# EAGLE design PCB (EAGLE 9.6.2)
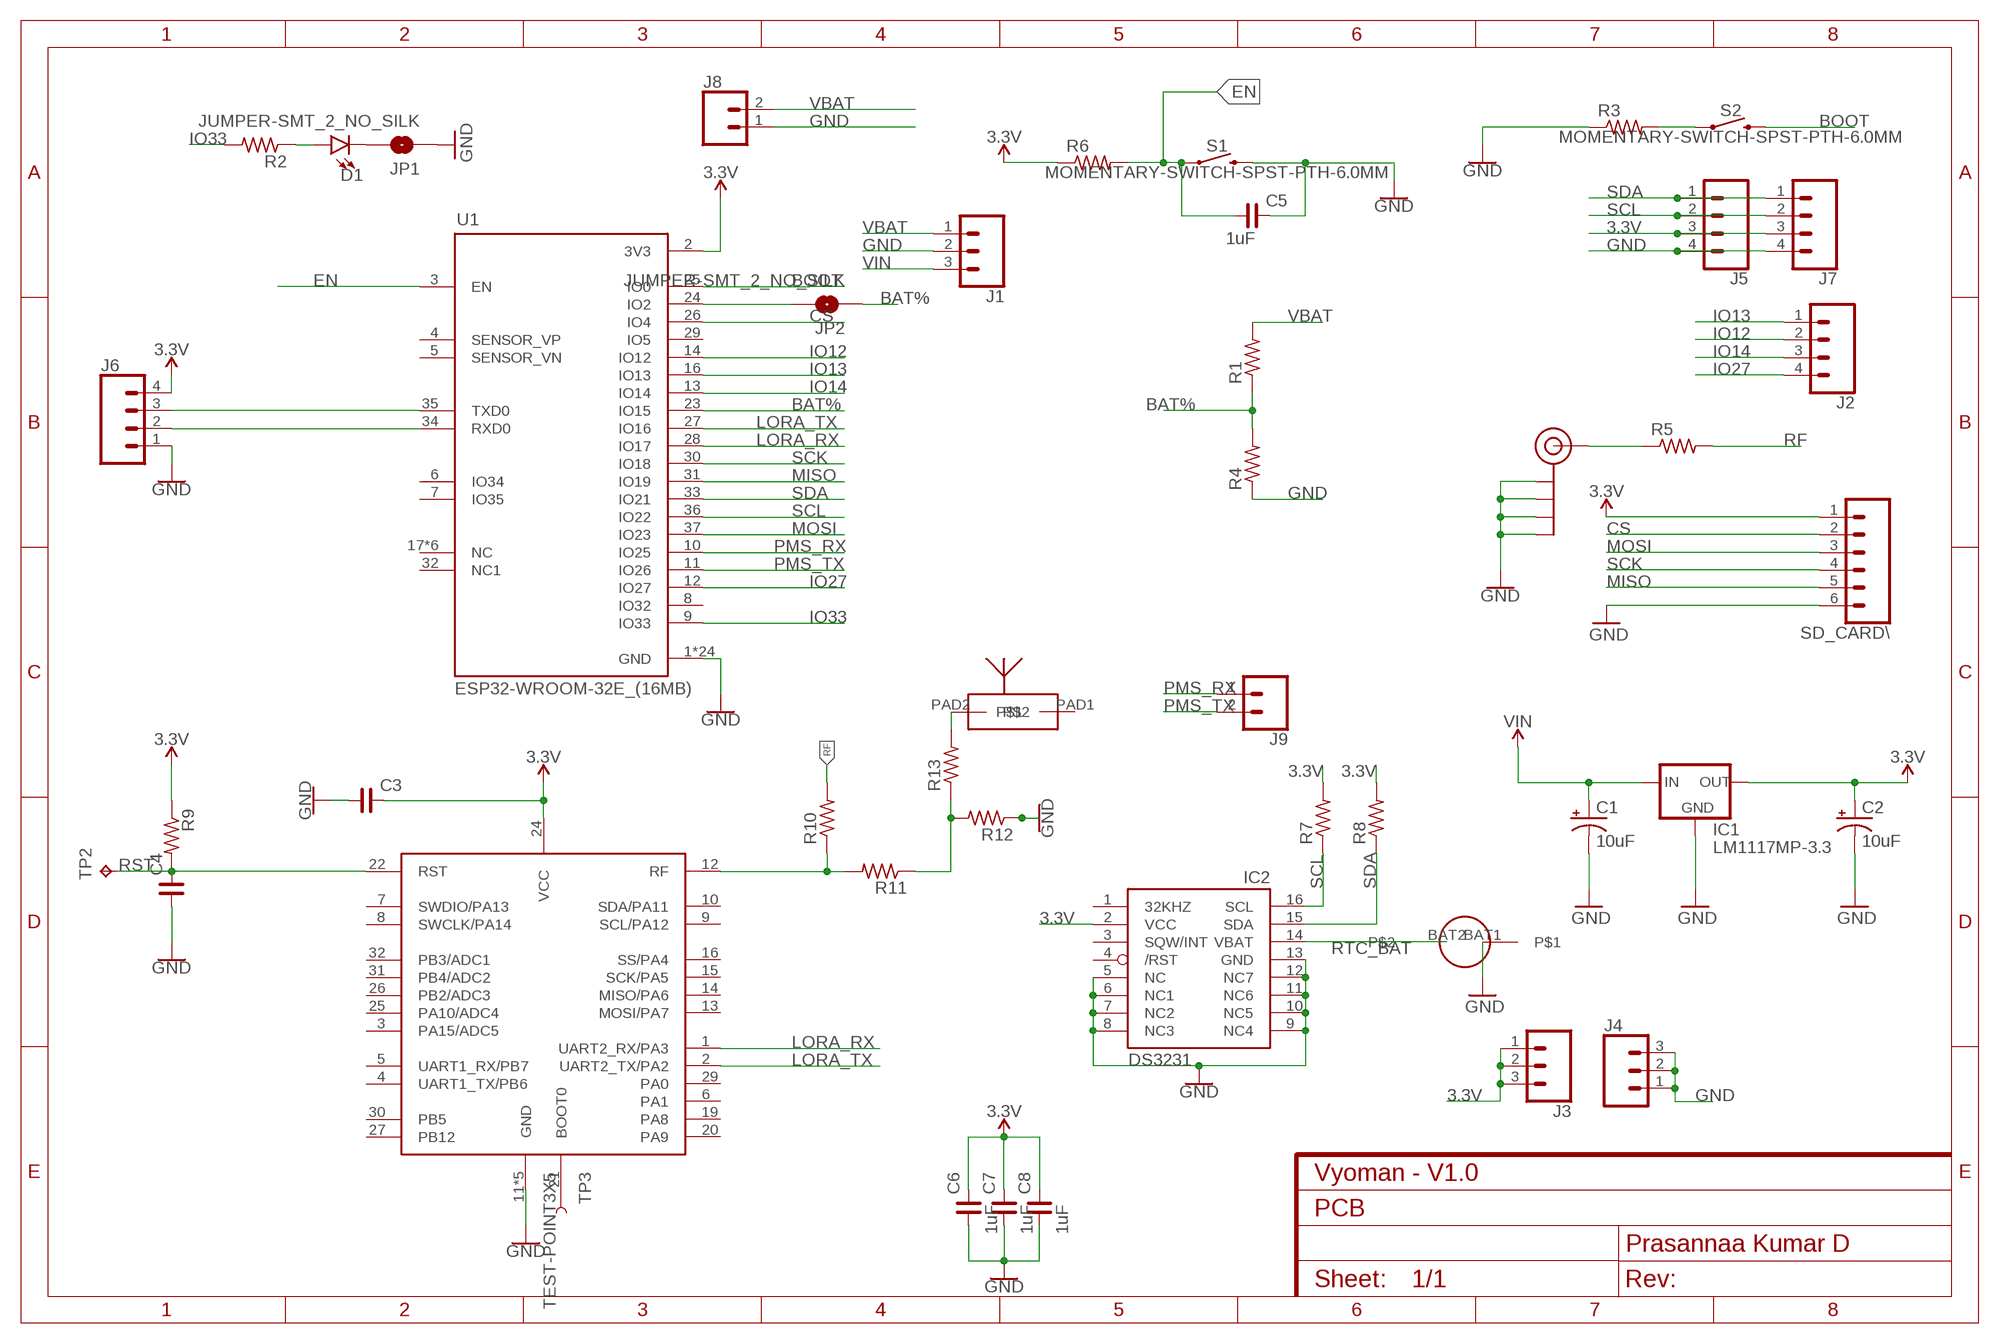
[diagram p0: schematic, sheet 1]
FRAME1 (FRAME-A4L): CNAME: Vyoman - V1.0; CREVISION: 1.0; DESIGNER: Prasannaa Kumar D

## Parts
C1  10uF  10UF-TANT  [EIA3216]
C2  10uF  10UF-TANT  [EIA3216]
C3  C_0805  [C0805]
C4  C_0805  [C0805]
C5  1uF  C_0805  [C0805]
C6  1uF  C_0805  [C0805]
C7  1uF  C_0805  [C0805]
C8  1uF  C_0805  [C0805]
D1  LED1206  [LED-1206]
IC1  LM1117MP-3.3  [SOT223]
IC2  DS3231/SO  [SO16W]
J1  CONN_031X03_NO_SILK  [1X03_NO_SILK]
J2  CONN_041X04_NO_SILK  [1X04_NO_SILK]
J3  CONN_031X03_NO_SILK  [1X03_NO_SILK]
J4  CONN_031X03_NO_SILK  [1X03_NO_SILK]
J5  CONN_041X04_NO_SILK  [1X04_NO_SILK]
J6  CONN_041X04_NO_SILK  [1X04_NO_SILK]
J7  CONN_041X04_NO_SILK  [1X04_NO_SILK]
J8  CONN_021X02_NO_SILK  [1X02_NO_SILK]
J9  CONN_021X02_NO_SILK  [1X02_NO_SILK]
J$1  SMA_EDGE  [SMA-EDGE]
JP1  JUMPER-SMT_2_NO_SILK  [SMT-JUMPER_2_NO_SILK]
JP2  JUMPER-SMT_2_NO_SILK  [SMT-JUMPER_2_NO_SILK]
R1  CRCW08050000Z0EA  [RES_0805]
R2  CRCW08050000Z0EA  [RES_0805]
R3  CRCW08050000Z0EA  [RES_0805]
R4  CRCW08050000Z0EA  [RES_0805]
R5  CRCW08050000Z0EA  [RES_0805]
R6  CRCW08050000Z0EA  [RES_0805]
R7  CRCW08050000Z0EA  [RES_0805]
R8  CRCW08050000Z0EA  [RES_0805]
R9  CRCW08050000Z0EA  [RES_0805]
R10  CRCW08050000Z0EA  [RES_0805]
R11  CRCW08050000Z0EA  [RES_0805]
R12  CRCW08050000Z0EA  [RES_0805]
R13  CRCW08050000Z0EA  [RES_0805]
S1  MOMENTARY-SWITCH-SPST-PTH-6.0MM  [TACTILE_SWITCH_PTH_6.0MM]
S2  MOMENTARY-SWITCH-SPST-PTH-6.0MM  [TACTILE_SWITCH_PTH_6.0MM]
SD_CARD\  CONN_06NO_SILK_FEMALE_PTH  [1X06_NO_SILK]
TP2  TPTP12R  [TP12R]
TP3  TEST-POINT3X5  [PAD.03X.05]
U1  ESP32-WROOM-32E_(16MB)  [MODULE_ESP32-WROOM-32E_(16MB)]
U$1  RAK3172HF  [RAK3172]
U$2  CR1220_HOLDER  [CR1220_HOLDER]
U$9  NN02-224  [NN02-224]

## Nets
3.3V: C2.A(+) C3.2 C6.2 C7.2 C8.2 IC1.2(OUT) IC1.4(OUT) IC2.2(VCC) J3.1 J3.2 J3.3 J5.3 J6.4 J7.3 R6.1 R7.2 R8.2 R9.1 SD_CARD\.1 U1.2(3V3) U$1.24(VCC)
BAT%: JP2.1 R1.1 R4.2 U1.23(IO15)
BOOT: S2.3 U1.25(IO0)
CS: SD_CARD\.2 U1.26(IO4)
EN: C5.1 R6.2 S1.1 U1.3(EN)
GND: C1.C(-) C2.C(-) C3.1 C4.1 C5.2 C6.1 C7.1 C8.1 IC1.1(GND) IC2.5(NC) IC2.6(NC1) IC2.7(NC2) IC2.8(NC3) IC2.9(NC4) IC2.10(NC5) IC2.11(NC6) IC2.12(NC7) IC2.13(GND) J1.2 J4.1 J4.2 J4.3 J5.4 J6.1 J7.4 J8.1 J$1.GND@0(GND) J$1.GND@1(GND) J$1.GND@2(GND) J$1.GND@3(GND) JP1.1 R3.1 R4.1 R12.1 S1.3 SD_CARD\.6 U1.1(GND) U1.15(GND) U1.38(GND) U1.39_1(GND) U1.39_2(GND) U1.39_3(GND) U1.39_4(GND) U1.39_5(GND) U1.39_6(GND) U1.39_7(GND) U1.39_8(GND) U1.39_9(GND) U1.39_10(GND) U1.39_11(GND) U1.39_12(GND) U1.39_13(GND) U1.39_14(GND) U1.39_15(GND) U1.39_16(GND) U1.39_17(GND) U1.39_18(GND) U1.39_19(GND) U1.39_20(GND) U1.39_21(GND) U$1.11(GND) U$1.17(GND) U$1.18(GND) U$1.23(GND) U$1.28(GND) U$2.BAT1
IO12: J2.2 U1.14(IO12)
IO13: J2.1 U1.16(IO13)
IO14: J2.3 U1.13(IO14)
IO27: J2.4 U1.12(IO27)
IO33: R2.2 U1.9(IO33)
LORA_RX: U1.28(IO17) U$1.1(UART2_RX/PA3)
LORA_TX: U1.27(IO16) U$1.2(UART2_TX/PA2)
MISO: SD_CARD\.5 U1.31(IO19)
MOSI: SD_CARD\.3 U1.37(IO23)
N$1: TP3.P$1 U$1.21(BOOT0)
N$2: D1.C JP1.2
N$3: R3.2 S2.1
N$4: J6.3 U1.35(TXD0)
N$5: J6.2 U1.34(RXD0)
N$6: D1.A R2.1
N$7: R13.2 U$9.PAD2
N$8: J$1.SIG(SIGNAL) R5.1
N$9: JP2.2 U1.24(IO2)
N$15: R11.1 R12.2 R13.1
N$16: R10.1 R11.2 U$1.12(RF)
PMS_RX: J9.1 U1.10(IO25)
PMS_TX: J9.2 U1.11(IO26)
RF: R5.2 R10.2
RST: C4.2 R9.2 TP2.TP U$1.22(RST)
RTC_BAT: IC2.14(VBAT) U$2.BAT2
SCK: SD_CARD\.4 U1.30(IO18)
SCL: IC2.16(SCL) J5.2 J7.2 R7.1 U1.36(IO22)
SDA: IC2.15(SDA) J5.1 J7.1 R8.1 U1.33(IO21)
VBAT: J1.1 J8.2 R1.2
VIN: C1.A(+) IC1.3(IN) J1.3
Unconnected: IC2.1(32KHZ) IC2.3(SQW/INT) IC2.4(/RST) U1.4(SENSOR_VP) U1.5(SENSOR_VN) U1.6(IO34) U1.7(IO35) U1.8(IO32) U1.17(NC) U1.18(NC) U1.19(NC) U1.20(NC) U1.21(NC) U1.22(NC) U1.29(IO5) U1.32(NC1) U$1.3(PA15/ADC5) U$1.4(UART1_TX/PB6) U$1.5(UART1_RX/PB7) U$1.6(PA1) U$1.7(SWDIO/PA13) U$1.8(SWCLK/PA14) U$1.9(SCL/PA12) U$1.10(SDA/PA11) U$1.13(MOSI/PA7) U$1.14(MISO/PA6) U$1.15(SCK/PA5) U$1.16(SS/PA4) U$1.19(PA8) U$1.20(PA9) U$1.25(PA10/ADC4) U$1.26(PB2/ADC3) U$1.27(PB12) U$1.29(PA0) U$1.30(PB5) U$1.31(PB4/ADC2) U$1.32(PB3/ADC1) U$9.PAD1

## Library data of the parts
C1 C2 = SparkFun-Retired:10UF-TANT: 10uF Tantalum SMT CAP-00811- 16V 10% (EIA-3216); PROD_ID: CAP-00811
C3-C8 = rc-master-smd:C_: NON-POLARIZED CAP
D1 = SparkFun-LED:LED: LED (Generic) Standard schematic elements and footprints for 5mm, 3mm, 1206, and 0603 sized LEDs. Generic LEDs with no color specified.
IC1 = lm1117_10:LM1117?-*: 800mA Low-Dropout Linear Regulator Source: http://www.ti.com/lit/ds/symlink/lm1117-n.pdf; MF: Texas Instruments; MPN: LM1117MP-3.3; OC_FARNELL: 9778195; OC_NEWARK: 28X3416
IC2 = DS3231:DS3231: Check prices <https://pricing.snapeda.com/parts/DS3231/Maxim%20Integrated/view-part?ref=eda>; AVAILABILITY: No availability data; DESCRIPTION: Real Time Clock (RTC) IC Clock/Calendar I²C, 2-Wire Serial 16-SOIC (0.295, 7.50mm Width); MF: Maxim Integrated; MP: DS3231; PACKAGE: SOIC-16 Maxim Integrated; PRICE: None; PURCHASE-URL: https://pricing.snapeda.com/search/part/DS3231/?ref=eda
J1 J3 J4 = SparkFun-Connectors:CONN_03: Multi connection point. Often used as Generic Header-pin footprint for 0.1 inch spaced/style header connections On any of the 0.1 inch spaced packages, you can populate with these: Break Away Headers - Straight <https://www.sparkfun.com/products/116> (PRT-00116) Break Away Male Headers - Right Angle <https://www.sparkfun.com/products/553> (PRT-00553) Female Headers <https://www.sparkfun.com/products/115> (PRT-00115) Break Away Headers - Machine Pin <https://www.sparkfun.com/products/117> (PRT-00117) Break Away Female Headers - Swiss Machine Pin <https://www.sparkfun.com/products/743> (PRT-00743) Stackable Header - 3 Pin (Female, 0.1") <https://www.sparkfun.com/products/13875> (PRT-13875) For SCREWTERMINALS and SPRING TERMINALS visit here: Screw Terimnals on SparkFun.com <https://www.sparkfun.com/search/results?term=Screw+Terminals> (5mm/3.5mm/2.54mm spacing) This device is also useful as a general connection point to wire up your design to another part of your project. Our various solder wires solder well into these plated through hole pads. Hook-Up Wire - Assortment (Stranded, 22 AWG) <https://www.sparkfun.com/products/11375> (PRT-11375) Hook-Up Wire - Assortment (Solid Core, 22 AWG) <https://www.sparkfun.com/products/11367> (PRT-11367) View the entire wire category on our website here <https://www.sparkfun.com/categories/141> Special notes: Molex polarized connector foot print use with SKU : PRT-08232 with associated crimp pins and housings.
J2 J5-J7 = SparkFun-Connectors:CONN_04: Multi connection point. Often used as Generic Header-pin footprint for 0.1 inch spaced/style header connections On any of the 0.1 inch spaced packages, you can populate with these: Break Away Headers - Straight <https://www.sparkfun.com/products/116> (PRT-00116) Break Away Male Headers - Right Angle <https://www.sparkfun.com/products/553> (PRT-00553) Female Headers <https://www.sparkfun.com/products/115> (PRT-00115) Break Away Headers - Machine Pin <https://www.sparkfun.com/products/117> (PRT-00117) Break Away Female Headers - Swiss Machine Pin <https://www.sparkfun.com/products/743> (PRT-00743) For SCREWTERMINALS and SPRING TERMINALS visit here: Screw Terimnals on SparkFun.com <https://www.sparkfun.com/search/results?term=Screw+Terminals> (5mm/3.5mm/2.54mm spacing) This device is also useful as a general connection point to wire up your design to another part of your project. Our various solder wires solder well into these plated through hole pads. Hook-Up Wire - Assortment (Stranded, 22 AWG) <https://www.sparkfun.com/products/11375> (PRT-11375) Hook-Up Wire - Assortment (Solid Core, 22 AWG) <https://www.sparkfun.com/products/11367> (PRT-11367) View the entire wire category on our website here <https://www.sparkfun.com/categories/141> Special notes: Molex polarized connector foot print use with SKU : PRT-08231 with associated crimp pins and housings. 1MM SMD Version SKU: PRT-10208; PROD_ID: CONN-09696
J8 J9 = SparkFun-Connectors:CONN_02: Multi connection point. Often used as Generic Header-pin footprint for 0.1 inch spaced/style header connections On any of the 0.1 inch spaced packages, you can populate with these: Break Away Headers - Straight <https://www.sparkfun.com/products/116> (PRT-00116) Break Away Male Headers - Right Angle <https://www.sparkfun.com/products/553> (PRT-00553) Female Headers <https://www.sparkfun.com/products/115> (PRT-00115) Break Away Headers - Machine Pin <https://www.sparkfun.com/products/117> (PRT-00117) Break Away Female Headers - Swiss Machine Pin <https://www.sparkfun.com/products/743> (PRT-00743) For SCREWTERMINALS and SPRING TERMINALS visit here: Screw Terimnals on SparkFun.com <https://www.sparkfun.com/search/results?term=Screw+Terminals> (5mm/3.5mm/2.54mm spacing) This device is also useful as a general connection point to wire up your design to another part of your project. Our various solder wires solder well into these plated through hole pads. Hook-Up Wire - Assortment (Stranded, 22 AWG) <https://www.sparkfun.com/products/11375> (PRT-11375) Hook-Up Wire - Assortment (Solid Core, 22 AWG) <https://www.sparkfun.com/products/11367> (PRT-11367) View the entire wire category on our website here <https://www.sparkfun.com/categories/141> Special notes: Molex polarized connector foot print use with: PRT-08233 with associated crimp pins and housings. 2.54_SCREWTERM for use with PRT-10571. 3.5mm Screw Terminal footprints for PRT-08084 5mm Screw Terminal footprints for use with PRT-08432
J$1 = SparkFun-Retired:SMA_EDGE: SMA Antenna Connector End launch SMA connector. The paste layer has been removed so that the connector can be hand soldered onto the board after reflow.
JP1 JP2 = SparkFun-Jumpers:JUMPER-SMT_2_NO: Normally open jumper This jumper has two pads in close proximity to each other. Apply solder to close the connection. Round pads are easier to solder for beginners, but are a lot larger. SparkFun Product that uses the round pads: SparkFun EL Sequencer <https://www.sparkfun.com/products/12781>
R1-R13 = Resistor_Capacitor:CRCW08050000Z0EA: RES SMD 0 OHM JUMPER 1/8W 0805 Manufacturer's datasheet <http://www.vishay.com/docs/20035/dcrcwe3.pdf>; CREATED_BY: PCBLayout.com; DIGIKEY_PART_NUMBER: 541-0.0ATR-ND; MANUFACTURER: Vishay Dale; MPN: CRCW08050000Z0EA; PACKAGE: SMD 0805
S1 S2 = SparkFun-Switches:MOMENTARY-SWITCH-SPST: Momentary Switch (Pushbutton) - SPST Normally-open (NO) SPST momentary switches (buttons, pushbuttons). Variants PTH-12MM - 12mm square, through-hole Momentary Pushbutton Switch - 12mm Square <https://www.sparkfun.com/products/9190> (COM-09190) PTH-6.0MM, PTH-6.0MM-KIT - 6.0mm square, through-hole Mini Pushbutton Switch <https://www.sparkfun.com/products/97> (COM-00097) KIT package intended for soldering kit's - only one side of pads' copper is exposed. PTH-RIGHT-ANGLE-KIT - Right-angle, through-hole Right Angle Tactile Button <https://www.sparkfun.com/products/10791> - Used on SparkFun BigTime Watch Kit <https://www.sparkfun.com/products/11734> SMD-12MM - 12mm square, surface-mount Tactile Button - SMD (12mm) <https://www.sparkfun.com/products/12993> (COM-12993) Used on SparkFun PicoBoard <https://www.sparkfun.com/products/11888> SMD-4.5MM - 4.5mm Square Trackball Switch Used on SparkFun Blackberry Trackballer Breakout <https://www.sparkfun.com/products/13169> SMD-4.6MMX2.8MM - 4.60mm x 2.80mm, surface mount Used on SparkFun SAMD21 Mini Breakout <https://www.sparkfun.com/products/13664> SMD-5.2MM, SMD-5.2-REDUNDANT - 5.2mm square, surface-mount Mini Pushbutton Switch - SMD <https://www.sparkfun.com/products/8720> (COM-08720) Used on Arduino Pro Mini <https://www.sparkfun.com/products/11114> REDUNDANT package connects both switch circuits together SMD-6.0X3.5MM - 6.0 x 3.5mm, surface mount Momentary Reset Switch SMD <https://www.sparkfun.com/products/8229> (COM-08229) SMD-6.2MM-TALL - 6.2mm square, surface mount Tactile Button - SMD (6mm) <https://www.sparkfun.com/products/12992> Used on SparkFun Digital Sandbox <https://www.sparkfun.com/products/12651> SMD-RIGHT-ANGLE - Right-angle, surface mount Used on SparkFun Block for Intel® Edison - Arduino <https://www.sparkfun.com/products/13036>; PROD_ID: SWCH-08441; SF_SKU: COM-00097
SD_CARD\ = SparkFun-Connectors:CONN_06: Multi connection point. Often used as Generic Header-pin footprint for 0.1 inch spaced/style header connections On any of the 0.1 inch spaced packages, you can populate with these: Break Away Headers - Straight <https://www.sparkfun.com/products/116> (PRT-00116) Break Away Male Headers - Right Angle <https://www.sparkfun.com/products/553> (PRT-00553) Female Headers <https://www.sparkfun.com/products/115> (PRT-00115) Break Away Headers - Machine Pin <https://www.sparkfun.com/products/117> (PRT-00117) Break Away Female Headers - Swiss Machine Pin <https://www.sparkfun.com/products/743> (PRT-00743) Arduino Stackable Header - 6 Pin <https://www.sparkfun.com/products/9280> (PRT-09280) For SCREWTERMINALS and SPRING TERMINALS visit here: Screw Terimnals on SparkFun.com <https://www.sparkfun.com/search/results?term=Screw+Terminals> (5mm/3.5mm/2.54mm spacing) This device is also useful as a general connection point to wire up your design to another part of your project. Our various solder wires solder well into these plated through hole pads. Hook-Up Wire - Assortment (Stranded, 22 AWG) <https://www.sparkfun.com/products/11375> (PRT-11375) Hook-Up Wire - Assortment (Solid Core, 22 AWG) <https://www.sparkfun.com/products/11367> (PRT-11367) View the entire wire category on our website here <https://www.sparkfun.com/categories/141>; PROD_ID: CONN-08437
TP2 = testpad:TP: Test pad
TP3 = SparkFun-Connectors:TEST-POINT: SparkFun Test Points Bare copper test points for troubleshooting or In-Circuit-Testing. These are used by our Production team for verifying production board runs using pogo-pins on test beds. SparkFun Products: SparkFun LSM9DS1 Breakout <https://www.sparkfun.com/products/13284> SparkFun PSOC <https://www.sparkfun.com/products/13714> SparkFun Load Cell Amplifier <https://www.sparkfun.com/products/13879>
U1 = ESP32-WROOM-32E:ESP32-WROOM-32E_(16MB): Bluetooth, WiFi 802.11b/g/n, Bluetooth v4.2 +EDR, Class 1, 2 and 3 Transceiver Module 2.4GHz ~ 2.5GHz Integrated, Trace Surface Mount Check prices <https://pricing.snapeda.com/parts/ESP32-WROOM-32E%20%2816MB%29/Espressif%20Systems/view-part?ref=eda>; AVAILABILITY: Not in stock; DESCRIPTION: Bluetooth, WiFi 802.11b/g/n, Bluetooth v4.2 +EDR, Class 1, 2 and 3 Transceiver Module 2.4GHz ~ 2.5GHz Integrated, Trace Surface Mount; MF: Espressif Systems; MP: ESP32-WROOM-32E (16MB); PACKAGE: Module Espressif Systems; PRICE: None
U$1 = RAK3172-Breakout:RAK3172: RAK4260 LoRaWAN module from RAKwireless.
U$2 = CR1220_HOLDER:CR1220_HOLDER
U$9 = NN02-224:NN02-224

## Net classes
0 Default: width 0.203 mm

## Board
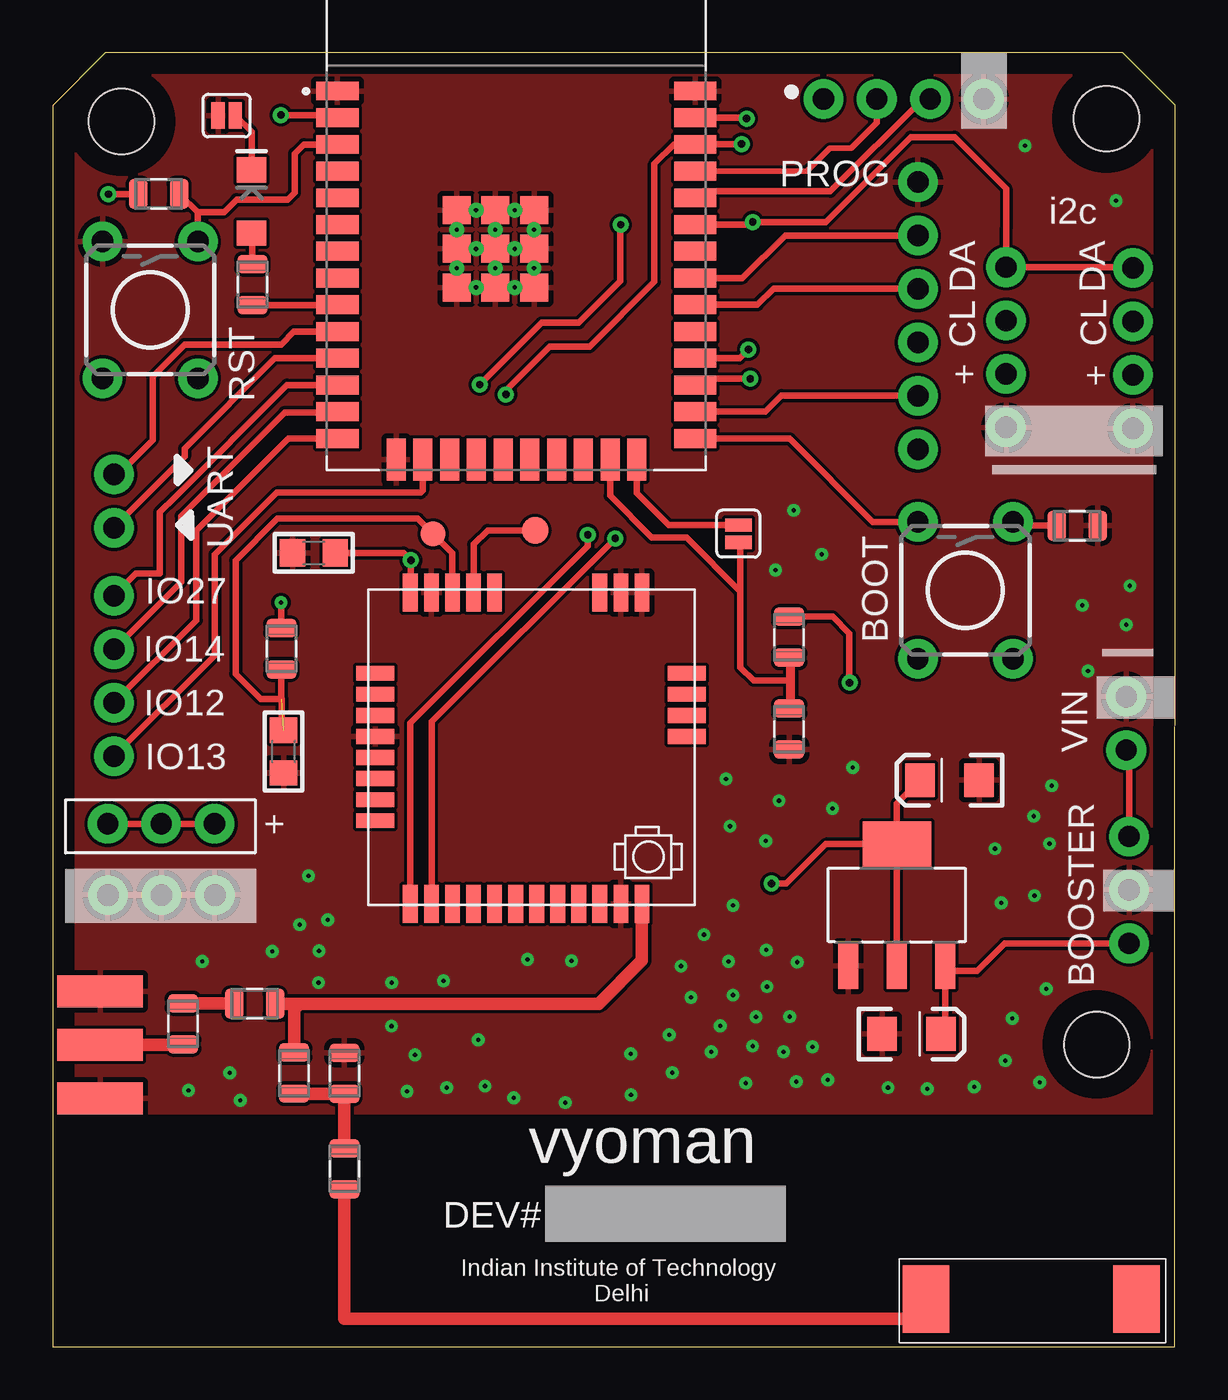
[diagram p1: board, top side]
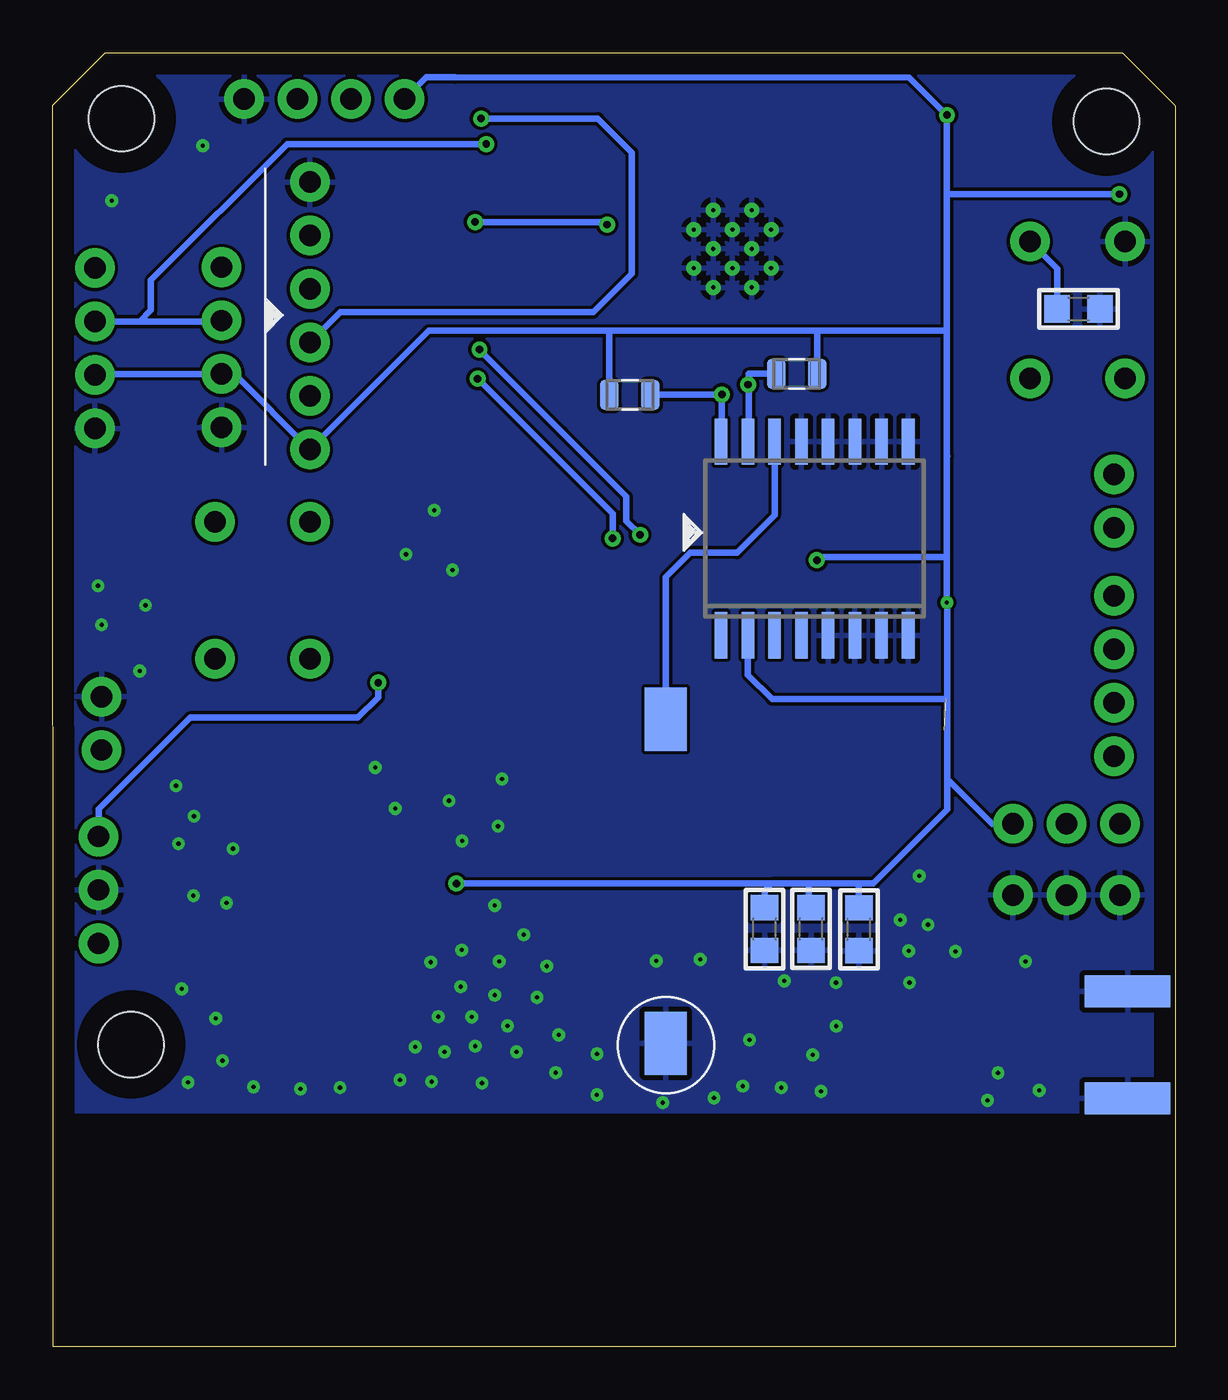
[diagram p2: board, bottom side, seen from below]

Size 53.31 x 61.49 mm. Coordinates in mm from the lower left corner, seen from the top.
Outline: 0.01,58.97 0,0 53.29,0.01 53.31,58.99 50.81,61.49 2.51,61.47 0.01,58.97
Copper layers (1*16): Top 0.035mm / dielectric 1.5mm / Bottom 0.035mm
Design rules "default": minimum track width 6mil, minimum drill 0.35mm, track to track 6mil, track to pad 6mil, pad to pad 6mil, via to via 6mil, smd to smd 6mil, copper to edge 40mil, drill to drill 6mil, minimum pad ring 10mil, minimum via ring 8mil, stop-mask expansion 4mil, vias tented up to drill 0mil, thermal gap 10mil
Holes 3.1 mm at 3.26,58.22 49.59,14.36 50.04,58.35

### Footprints (pad centres in the part's own frame; a part is rotated, then mirrored left to right if it is on the bottom)
EIA3216 = smd 1.4 x 1.6: A 1.4,0; C -1.4,0
C0805 = smd 1.2 x 1.3: 1 -1.016,0; 2 1.016,0
LED-1206 = smd 1.2 x 1.4: A -1.5,0; C 1.5,0
SOT223 = smd 0.95 x 2.15: 1 -2.3,-2.9; 2 0,-2.9; 3 2.3,-2.9 | smd 3.25 x 2.15: 4 0,2.9
SO16W = smd 0.6 x 2.2: 1 -4.445,-4.6; 2 -3.175,-4.6; 3 -1.905,-4.6; 4 -0.635,-4.6; 5 0.635,-4.6; 6 1.905,-4.6; 7 3.175,-4.6; 8 4.445,-4.6; 9 4.445,4.6; 10 3.175,4.6; 11 1.905,4.6; 12 0.635,4.6; 13 -0.635,4.6; 14 -1.905,4.6; 15 -3.175,4.6; 16 -4.445,4.6
1X03_NO_SILK = drill 1.016 pad 1.88: 1 0,0; 2 2.54,0; 3 5.08,0
1X04_NO_SILK = drill 1.016 pad 1.88: 1 0,0; 2 2.54,0; 3 5.08,0; 4 7.62,0
1X02_NO_SILK = drill 1.016 pad 1.88: 1 0,0; 2 2.54,0
SMA-EDGE = smd 1.524 x 4.064: GND@0 0,0; GND@1 5.08,0; SIG 2.54,0 | smd 1.524 x 4.064 bottom: GND@2 0,0; GND@3 5.08,0
SMT-JUMPER_2_NO_SILK = smd 0.635 x 1.27: 1 -0.406,0; 2 0.406,0
RES_0805 = smd 0.87 x 1.42: 1 -0.975,0; 2 0.975,0
TACTILE_SWITCH_PTH_6.0MM = drill 1.016 pad 1.88: 1 -3.251,2.261; 2 3.251,2.261; 3 -3.251,-2.261; 4 3.251,-2.261
1X06_NO_SILK = drill 1.016 pad 1.88: 1 0,0; 2 2.54,0; 3 5.08,0; 4 7.62,0; 5 10.16,0; 6 12.7,0
TP12R = smd 1.2 x 1.2: TP 0,0
PAD.03X.05 = smd 1.27 x 1.27: P$1 0,0
MODULE_ESP32-WROOM-32E_(16MB) = smd 2 x 0.9: 1 -8.5,5.26; 2 -8.5,3.99; 3 -8.5,2.72; 4 -8.5,1.45; 5 -8.5,0.18; 6 -8.5,-1.09; 7 -8.5,-2.36; 8 -8.5,-3.63; 9 -8.5,-4.9; 10 -8.5,-6.17; 11 -8.5,-7.44; 12 -8.5,-8.71; 13 -8.5,-9.98; 14 -8.5,-11.25; 25 8.5,-11.25; 26 8.5,-9.98; 27 8.5,-8.71; 28 8.5,-7.44; 29 8.5,-6.17; 30 8.5,-4.9; 31 8.5,-3.63; 32 8.5,-2.36; 33 8.5,-1.09; 34 8.5,0.18; 35 8.5,1.45; 36 8.5,2.72; 37 8.5,3.99; 38 8.5,5.26 | smd 0.9 x 2: 15 -5.715,-12.25; 16 -4.445,-12.25; 17 -3.175,-12.25; 18 -1.905,-12.25; 19 -0.635,-12.25; 20 0.635,-12.25; 21 1.905,-12.25; 22 3.175,-12.25; 23 4.445,-12.25; 24 5.715,-12.25 | smd 1.33 x 1.33: 39_1 -2.835,-0.405; 39_2 -1,-0.405; 39_3 0.835,-0.405; 39_4 -2.835,-2.24; 39_5 -1,-2.24; 39_6 0.835,-2.24; 39_7 -2.835,-4.075; 39_8 -1,-4.075; 39_9 0.835,-4.075 | drill 0.2 pad 0.3: 39_10 -1.917,-0.405; 39_11 -0.083,-0.405; 39_12 -2.835,-1.323; 39_13 -1,-1.323; 39_14 0.835,-1.323; 39_15 -1.917,-2.24; 39_16 -0.083,-2.24; 39_17 -2.835,-3.158; 39_18 -1,-3.158; 39_19 0.835,-3.158; 39_20 -1.917,-4.075; 39_21 -0.083,-4.075
RAK3172 = smd 0.7 x 1.8: 1 13.5,14.945; 2 12.5,14.945; 3 11.5,14.945; 4 10.5,14.945; 5 9.5,14.945; 6 8.5,14.945; 7 7.5,14.945; 8 6.5,14.945; 9 5.5,14.945; 10 4.5,14.945; 11 3.5,14.945; 12 2.5,14.945; 17 2.5,0.145; 18 3.5,0.145; 19 4.5,0.145; 20 9.5,0.145; 21 10.5,0.145; 22 11.5,0.145; 23 12.5,0.145; 24 13.5,0.145 | smd 1.8 x 0.7: 13 0.365,6.99; 14 0.365,5.99; 15 0.365,4.99; 16 0.365,3.99; 25 15.165,3.99; 26 15.165,4.99; 27 15.165,5.99; 28 15.165,6.99; 29 15.165,7.99; 30 15.165,8.99; 31 15.165,9.99; 32 15.165,10.99
CR1220_HOLDER = smd 3 x 2: BAT1 2.155,1.737; BAT2 17.555,1.737
NN02-224 = smd 2.2 x 3.2: PAD1 1.233,1.731; PAD2 11.233,1.731

### Placement (x,y rotation side)
C1  40.79,14.87 0 top
C2  42.6,26.92 180 top
C3  12.41,37.72 0 top
C4  10.97,28.28 90 top
C5  4.59,49.31 0 bottom
C6  15.02,19.84 90 bottom
C7  17.29,19.85 90 bottom
C8  19.5,19.85 90 bottom
D1  9.45,54.42 90 top
IC1  40.09,20.99 0 top
IC2  17.12,38.41 0 bottom
J1  51.13,24.25 270 top
J2  2.91,28.06 90 top
J3  7.7,24.85 180 top
J4  7.71,21.46 180 top
J5  45.28,51.3 270 top
J6  44.22,59.28 180 top
J7  51.31,51.26 270 top
J8  50.99,30.9 270 top
J9  2.92,41.45 270 top
J$1  2.26,16.89 270 top
JP1  8.26,58.5 0 top
JP2  32.57,38.63 90 top
R1  34.97,33.72 90 top
R2  9.49,50.46 270 top
R3  48.66,39.01 180 top
R4  34.98,29.35 90 top
R5  6.19,15.36 90 top
R6  5.03,54.77 0 top
R7  25.89,45.22 180 bottom
R8  17.98,46.24 0 bottom
R9  10.86,33.17 270 top
R10  9.59,16.3 180 top
R11  11.47,13.01 90 top
R12  13.86,13 270 top
R13  13.85,8.46 270 top
S1  4.64,49.27 270 top
S2  43.35,35.94 270 top
SD_CARD\  41.09,42.64 90 top
TP2  18.07,38.62 0 top
TP3  22.91,38.79 0 top
U1  22.03,54.41 0 top
U$1  30.49,35.99 180 top
U$2  22.45,12.26 90 bottom
U$9  52.71,4 180 top

### Tracks (layer width: path | path; a pad name or v marks a point on that pad's centre or on a via)
3.3V  (via drill 0.2, 0.35)
  Top 0.305: U1.2 13.4,58.52 v10.84,58.52 | J3.3 J3.2 J3.1 | R6.1 v2.65,54.76 | C3.2 16.67,37.72 v17.02,37.38 17.02,35.87 U$1.24 | R9.1 10.86,35.35 v10.84,35.37 | IC1.2 IC1.4 | C2.A 40.09,25.81 IC1.4 | IC1.4 36.72,23.89 34.84,22.01 v34.14,22.01
  Bottom 0.305: 10.84,54.73 v10.84,58.52 12.62,60.31 34.2,60.32 35.57,60.32 J6.4 | 10.84,54.73 10.84,48.27 | 10.84,48.27 10.84,42.34 | 10.84,42.34 10.84,37.54 | 10.84,37.54 v10.84,35.37 10.81,35.34 10.81,30.78 | 14.93,22.01 14.34,22.01 10.81,25.54 10.81,26.97 | 14.93,22.01 17.4,22.01 | 17.4,22.01 19.17,22.01 | 10.84,37.54 16.86,37.54 v17.02,37.38 | 26.93,48.27 35.46,48.27 SD_CARD\.1 44.67,46.22 J5.3 51.27,46.22 J7.3 | 26.93,48.27 16.99,48.27 | 16.99,48.27 10.84,48.27 | 10.82,42.32 10.84,42.34 | R8.2 17,48.26 16.99,48.27 | R7.2 26.87,48.21 26.93,48.27 | v2.65,54.76 10.8,54.76 10.84,54.73 | 10.81,30.78 10.81,26.97 | 10.81,26.97 8.7,24.85 J3.1 | 14.93,22.01 15.02,21.93 C6.2 | 17.4,22.01 17.4,20.98 C7.2 | 19.17,22.01 19.5,21.68 C8.2 | IC2.2 20.29,31.93 19.15,30.78 10.81,30.78 | 19.17,22.01 33.16,22.01 33.17,22.01 v34.14,22.01
BAT%
  Top 0.305: 32.67,35.88 32.67,32.28 33.29,31.66 35.1,31.66 35.1,32.62 R1.1 R4.2 35.1,30.45 35.1,31.66 | U1.23 26.47,40.44 28.46,38.44 30.11,38.44 32.67,35.88 | JP2.1 32.67,38.13 32.67,35.88
BOOT
  Top 0.305: U1.25 30.54,43.14 35.01,43.14 38.96,39.19 S2.3
CS
  Top 0.305: U1.26 33.84,44.43 34.61,45.2 41.08,45.2 SD_CARD\.2
EN
  Top 0.305: S1.1 6.9,53.91 | R6.2 6.9,53.91 | 6.9,53.91 8.14,53.91 8.73,54.51 11.18,54.51 11.5,54.83 11.5,56.69 11.94,57.13 U1.3
  Bottom 0.305: S1.1 5.61,51.23 C5.1
GND  (via drill 0.2)
  Top 0.305: J4.3 J4.2 J4.1
  other vias: 17.21,13.87 20.54,12.39 20.21,14.59 27.46,13.93 30.31,16.6 30.94,19.58 31.97,26.98 32.31,20.97 31.28,14.01 34.71,14.01 35,15.69 41.54,12.25 45.24,13.6 45.57,15.61 33.93,17.12 35.36,18.28 34.49,25.95 36.53,37.66 48.9,35.23 34.33,36.9 46.18,57.06 49.17,32.11 12.16,22.37 29.42,13.03 29.28,14.82 31.71,15.25 32.92,12.53 33.24,14.28 33.41,15.67 36.09,14.25 32.32,16.71 32.1,18.32 33.89,18.85 35.31,12.61 36.82,12.68 39.67,12.32 43.78,12.36 47.18,17 46.88,12.57 18.71,12.32 32.17,24.74 35.19,39.75 47.45,26.66 50.5,54.45 51.16,36.16 18.56,17.39 8.41,13.01 6.45,12.18 7.11,18.31 10.43,18.78 13.06,20.28 27.46,11.97 16.82,12.14 8.91,11.71 47.34,23.9 46.63,21.44 24.64,18.34 16.11,17.31 12.62,17.3 11.74,20.06 12.65,18.81 22.56,18.41 44.75,23.66 46.6,25.21 38,27.52 37.04,25.57 50.99,34.3 21.9,11.83 24.34,11.61 29.85,18.08 33.87,24.04 45.05,21.1 16.1,15.24
  pour Top: 43.12,61.24 50.84,61.24 53.16,58.93 53.16,11.08 0.17,11.08 0.17,58.76 2.7,61.29 43.07,61.29 43.11,61.25
  pour Bottom: 3.52,61.32 50.75,61.32 53.13,58.94 53.13,11.18 0.26,11.18 0.26,58.7 2.89,61.33 3.53,61.33 3.54,61.32
IO12
  Top 0.305: J2.2 6.82,34.52 6.82,38.79 11.19,43.16 U1.14
IO13
  Top 0.305: U1.16 17.57,42.14 17.57,40.67 17.48,40.59 10.64,40.59 7.7,37.64 7.7,32.85 J2.1
IO14
  Top 0.305: U1.13 13.49,44.39 11.02,44.39 6.1,39.48 6.1,36.34 J2.3
IO27
  Top 0.305: J2.4 3.96,36.73 5.08,36.73 5.08,39.65 5.79,40.36 11.13,45.7 U1.12
IO33
  Top 0.305: U1.9 13.51,49.49 R2.2
LORA_RX  (via drill 0.35)
  Top 0.305: v33.04,47.38 32.62,46.97 U1.28 | v25.41,38.58 25.41,38.06 16.99,29.63 U$1.1
  Bottom 0.305: v33.04,47.38 29.13,43.47 29.13,43.46 26.06,40.4 26.06,39.23 v25.41,38.58
LORA_TX  (via drill 0.35)
  Top 0.305: U1.27 30.82,45.99 v33.13,45.99 | U$1.2 18.01,21.06 18.01,29.7 v26.72,38.41
  Bottom 0.305: v26.72,38.41 26.72,39.58 v33.13,45.99
MISO
  Top 0.305: U1.31 32.76,50.78 34.78,52.8 SD_CARD\.5
MOSI  (via drill 0.35)
  Top 0.305: U1.37 32.92,58.4 v32.96,58.36
  Bottom 0.305: v32.96,58.36 27.42,58.36 25.8,56.74 25.8,50.99 27.64,49.16 39.65,49.16 SD_CARD\.3
N$1
  Top 0.305: TP3.P$1 20.65,38.79 19.99,38.13 U$1.21
N$2
  Top 0.305: D1.C 9.45,57.72 JP1.2
N$3
  Top 0.305: S2.1 45.79,39.01 R3.2
N$4
  Top 0.254: U1.35 35.82,55.86 36.91,56.94 37.92,56.94 38.46,57.48
  Top 0.305: 38.46,57.48 39.14,58.16 J6.3
N$5
  Top 0.254: 30.59,54.59 U1.34
  Top 0.305: 30.59,54.59 30.91,54.91 36.94,54.91 41.32,59.28 J6.2
N$6
  Top 0.305: R2.1 9.49,52.88 D1.A
N$7
  Top 0.6: R13.2 13.85,1.33 41.48,1.33 U$9.PAD2
N$8
  Top 0.6: R5.1 6.19,14.35 J$1.SIG
N$9
  Top 0.305: U1.24 27.74,40.55 29.25,39.04 JP2.2
N$15
  Top 0.6: R11.1 R12.2 R13.1
N$16
  Top 0.6: U$1.12 27.99,18.35 25.94,16.3 11.76,16.3 | 11.76,16.3 R10.1 | 11.76,16.3 11.47,16.01 R11.2
PMS_RX
  Top 0.305: U1.10 13.48,48.19 | 13.49,48.2 U1.10 | U1.10 11.46,48.24 10.85,47.63 6.27,47.63 4.75,46.11 4.75,43.09 3.11,41.45 J9.1
PMS_TX
  Top 0.305: U1.11 10.55,46.97 6.27,42.68 6.27,42.29 2.92,38.94 J9.2
RF
  Top 0.6: R5.2 8.59,16.33 R10.2
RST  (1 unrouted)
  Top 0.305: R9.2 10.86,30.8 10.88,30.78 | C4.2 10.87,29.4 10.87,30.78 9.89,30.78 8.69,31.98 8.69,37.37 10.67,39.35 17.34,39.35 TP2.TP 18.99,37.71 18.99,37.24 18.99,35.91 U$1.22
RTC_BAT
  Bottom 0.305: IC2.14 19.02,39.51 20.8,37.73 23.02,37.73 24.19,36.57 U$2.BAT2
SCK
  Top 0.305: U1.30 33.47,49.51 34.24,50.28 41.08,50.28 SD_CARD\.4
SCL  (via drill 0.35)
  Top 0.305: v32.72,57.14 30.54,57.14 U1.36 29.49,57.13 28.58,56.21 28.58,50.6 25.5,47.52 23.6,47.52 21.53,45.44 v21.53,45.25
  Bottom 0.305: v32.72,57.14 42.18,57.14 48.65,50.67 48.65,49.25 49.18,48.72 J7.2 45.32,48.72 J5.2 | R7.1 24.9,45.25 v21.53,45.25 21.54,45.24 21.54,43.04 IC2.16
SDA  (via drill 0.35)
  Top 0.305: U1.33 33.12,53.32 v33.25,53.44 36.71,53.44 40.75,57.48 42.84,57.48 45.28,55.03 45.28,53.11 45.28,52.75 J5.1 51.27,51.3 J7.1 | v20.28,45.72 23.22,48.65 24.99,48.65 26.97,50.63 26.97,53.3 v26.98,53.31
  Bottom 0.305: IC2.15 20.33,43.04 20.26,43.11 20.26,45.69 | v20.28,45.72 20.26,45.69 | R8.1 20.26,46.24 20.26,45.69 | v26.98,53.31 27.11,53.44 v33.25,53.44
VBAT  (via drill 0.35)
  Top 0.254: 51.13,27.57 J1.1
  Top 0.305: R1.2 37.04,34.69 37.84,33.89 v37.84,31.56 v37.85,31.56 | J8.2 51.13,28.22 J1.1
  Bottom 0.305: J1.1 51.13,25.55 46.79,29.89 38.81,29.89 37.85,30.86 v37.85,31.56
VIN
  Top 0.305: J1.3 45.21,19.17 43.9,17.86 42.62,17.86 IC1.3 42.39,15.07 C1.A

### Text on the board
tNames: PROG | i2c | DA | DA | CL | CL | RST | + | + | UART | IO27 | BOOT | IO14 | IO12 | VIN | IO13 | + | BOOSTER | vyoman | DEV# | Indian Institute of Technology / Delhi